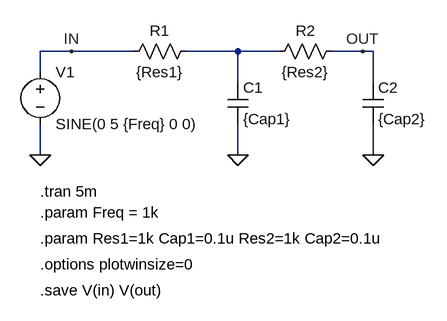
[diagram p0: schematic VideoAulaPythonLTspice.asc]
VideoAulaPythonLTspice.asc, the LTspice schematic file:
Version 4
SHEET 1 880 680
WIRE 112 32 64 32
WIRE 208 32 112 32
WIRE 368 32 288 32
WIRE 432 32 368 32
WIRE 560 32 512 32
WIRE 576 32 560 32
WIRE 64 64 64 32
WIRE 368 80 368 32
WIRE 576 80 576 32
WIRE 64 192 64 144
WIRE 368 192 368 144
WIRE 576 192 576 144
FLAG 576 192 0
FLAG 368 192 0
FLAG 64 192 0
FLAG 560 32 OUT
FLAG 112 32 IN
SYMBOL voltage 64 48 R0
SYMATTR InstName V1
SYMATTR Value SINE(0 5 {Freq} 0 0)
SYMBOL res 304 16 R90
WINDOW 0 0 56 VBottom 2
WINDOW 3 32 56 VTop 2
SYMATTR InstName R1
SYMATTR Value {Res1}
SYMBOL res 528 16 R90
WINDOW 0 0 56 VBottom 2
WINDOW 3 32 56 VTop 2
SYMATTR InstName R2
SYMATTR Value {Res2}
SYMBOL cap 352 80 R0
SYMATTR InstName C1
SYMATTR Value {Cap1}
SYMBOL cap 560 80 R0
SYMATTR InstName C2
SYMATTR Value {Cap2}
TEXT 64 248 Left 2 !.tran 5m
TEXT 64 280 Left 2 !.param Freq = 1k
TEXT 64 320 Left 2 !.param Res1=1k Cap1=0.1u Res2=1k Cap2=0.1u
TEXT 64 360 Left 2 !.options plotwinsize=0
TEXT 64 400 Left 2 !.save V(in) V(out)

The netlist it stands for:
* VideoAulaPythonLTspice.asc
V1 IN 0 SINE(0 5 {Freq} 0 0)
R1 N001 IN {Res1}
R2 OUT N001 {Res2}
C1 N001 0 {Cap1}
C2 OUT 0 {Cap2}
.tran 5m
.param Freq = 1k
.param Res1=1k Cap1=0.1u Res2=1k Cap2=0.1u
.options plotwinsize=0
.save V(in) V(out)
.backanno
.end